# Altium schematic sheet S01-INTERFACES.SchDoc
size B; SheetNumber: 2; SheetTotal: 3; BLOCK-TITLE: SERVO MODULE INTERFACES; BLOCK-SIZE: B; BLOCK-PROJECT: MULTIMOD SERVO MODULE; BLOCK-REVISION: 1; BLOCK-ORGANIZATION: UNIVERSITY OF FLORIDA; BLOCK-DESIGNER: MEHRON TALEBI; BLOCK-IDENTIFIER: SUMMER 2023; BLOCK-REVIEWER: MIKE STAPLETON
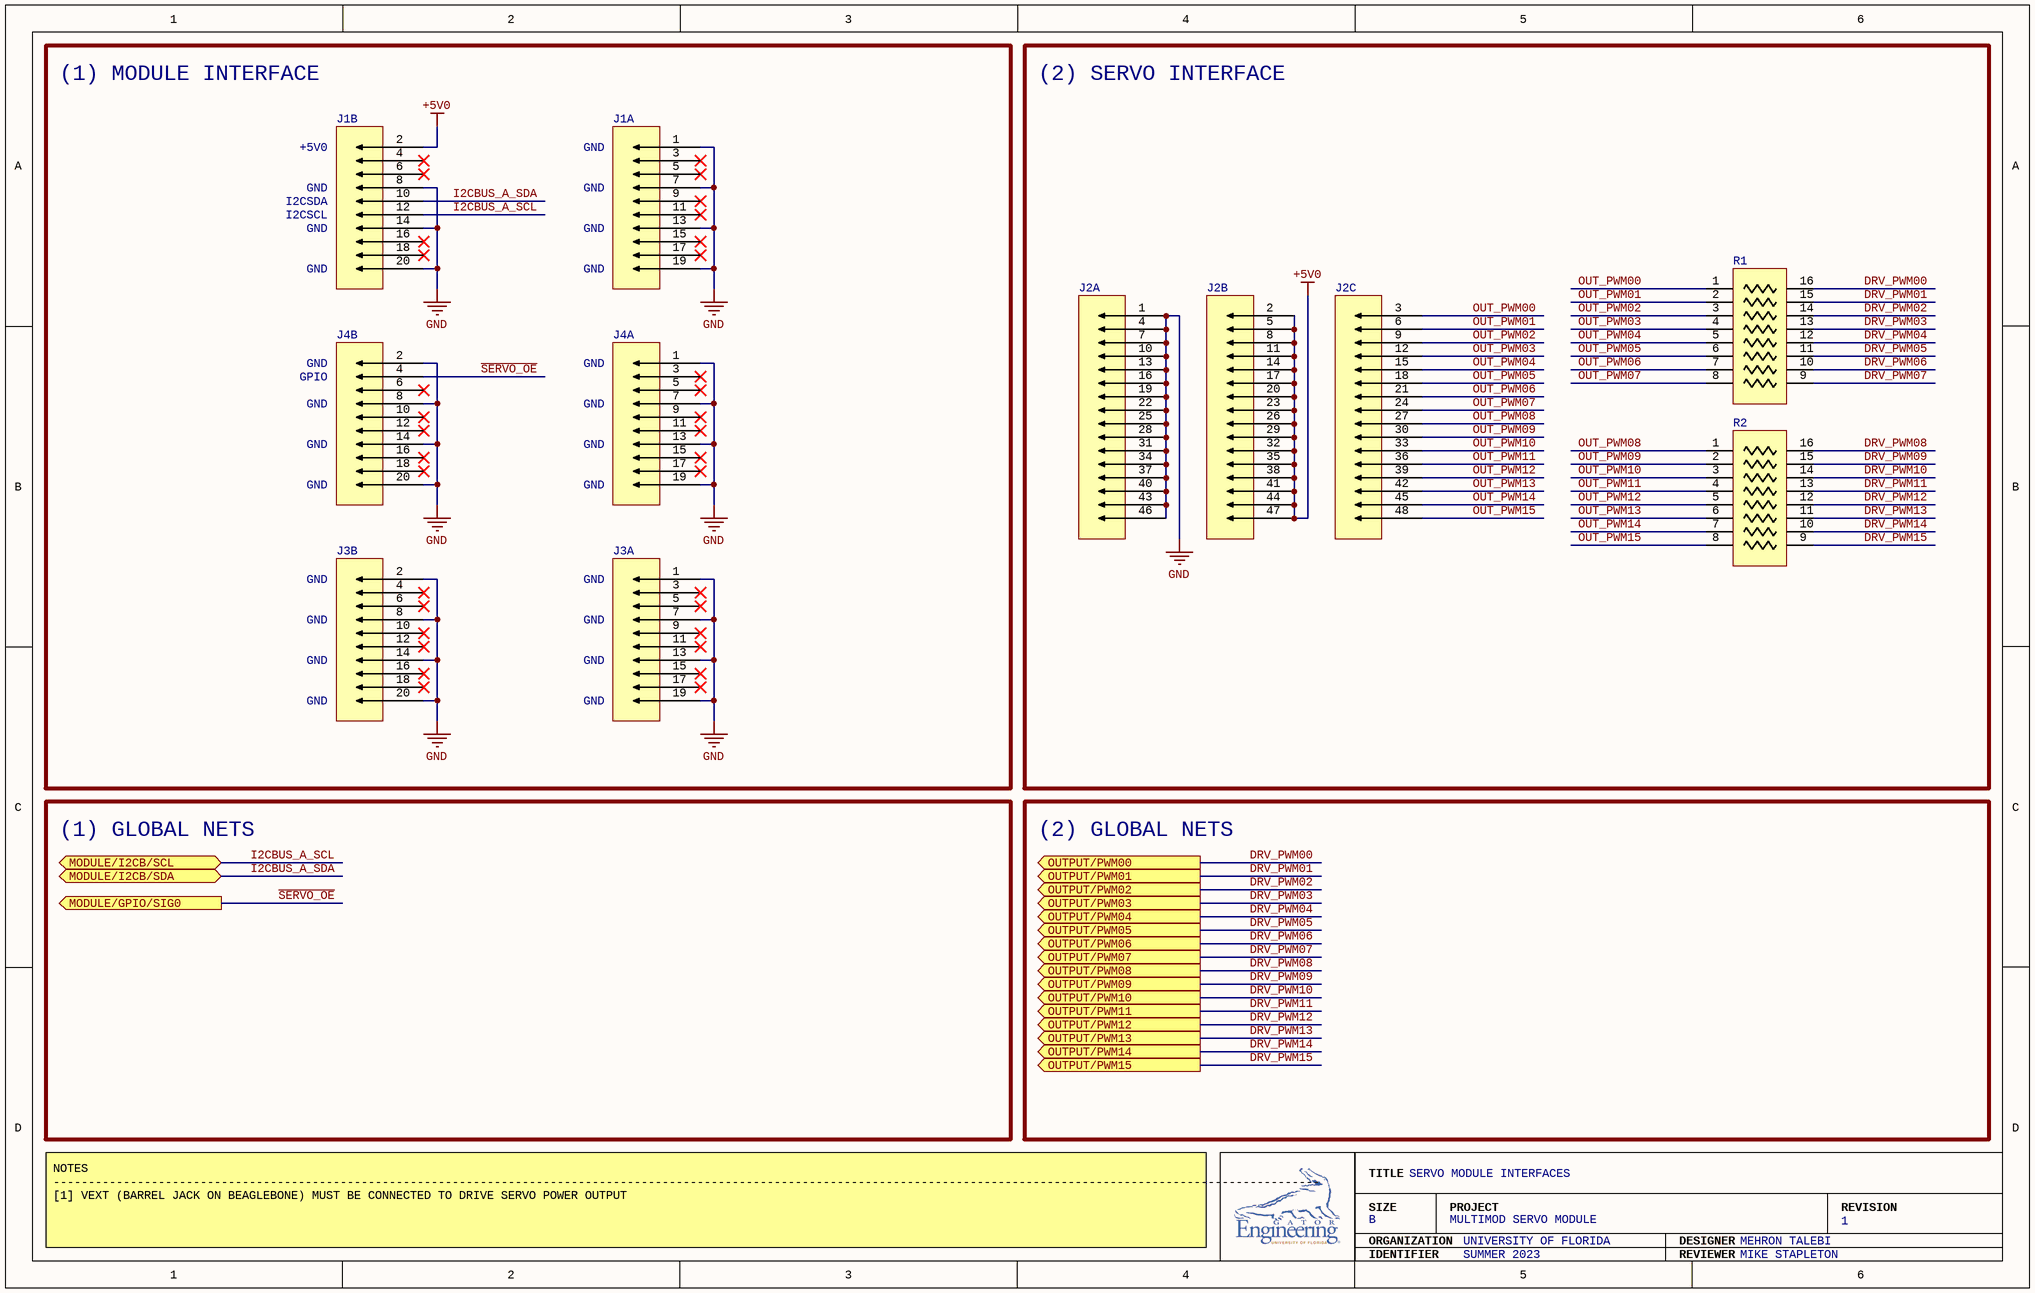
[diagram p0: S01-INTERFACES.SchDoc]

## Parts
J1  NPTC102KFMS-RC  [NPTC102KFMS-RC]  (value not drawn)  (parts A,B of 2)
J2  TSW-116-07-L-T  [TSW-116-07-L-T]  (value not drawn)  (parts A,B,C of 3)
J3  NPTC102KFMS-RC  [NPTC102KFMS-RC]  (value not drawn)  (parts A,B of 2)
J4  NPTC102KFMS-RC  [NPTC102KFMS-RC]  (value not drawn)  (parts A,B of 2)
R1  EXB-2HV221JV  [EXB-2HV221JV]  (value not drawn)
R2  EXB-2HV221JV  [EXB-2HV221JV]  (value not drawn)

## Blocks framed on the sheet
(1) MODULE INTERFACE: J1 J3 J4
(2) SERVO INTERFACE: J2 R1 R2

## Ports
MODULE/GPIO/SIG0 (out), MODULE/I2CB/SCL (bidir), MODULE/I2CB/SDA (bidir), OUTPUT/PWM00 (out), OUTPUT/PWM01 (out), OUTPUT/PWM02 (out), OUTPUT/PWM03 (out), OUTPUT/PWM04 (out), OUTPUT/PWM05 (out), OUTPUT/PWM06 (out), OUTPUT/PWM07 (out), OUTPUT/PWM08 (out), OUTPUT/PWM09 (out), OUTPUT/PWM10 (out), OUTPUT/PWM11 (out), OUTPUT/PWM12 (out), OUTPUT/PWM13 (out), OUTPUT/PWM14 (out), OUTPUT/PWM15 (out)

## Nets
+5V0: J1.2 J2.2 J2.5 J2.8 J2.11 J2.14 J2.17 J2.20 J2.23 J2.26 J2.29 J2.32 J2.35 J2.38 J2.41 J2.44 J2.47
GND: J1.1 J1.7 J1.8 J1.13 J1.14 J1.19 J1.20 J2.1 J2.4 J2.7 J2.10 J2.13 J2.16 J2.19 J2.22 J2.25 J2.28 J2.31 J2.34 J2.37 J2.40 J2.43 J2.46 J3.1 J3.2 J3.7 J3.8 J3.13 J3.14 J3.19 J3.20 J4.1 J4.2 J4.7 J4.8 J4.13 J4.14 J4.19 J4.20
~{SERVO_OE}: J4.4 ; port MODULE/GPIO/SIG0
DRV_PWM00: R1.16 ; port OUTPUT/PWM00
DRV_PWM01: R1.15 ; port OUTPUT/PWM01
DRV_PWM02: R1.14 ; port OUTPUT/PWM02
DRV_PWM03: R1.13 ; port OUTPUT/PWM03
DRV_PWM04: R1.12 ; port OUTPUT/PWM04
DRV_PWM05: R1.11 ; port OUTPUT/PWM05
DRV_PWM06: R1.10 ; port OUTPUT/PWM06
DRV_PWM07: R1.9 ; port OUTPUT/PWM07
DRV_PWM08: R2.16 ; port OUTPUT/PWM08
DRV_PWM09: R2.15 ; port OUTPUT/PWM09
DRV_PWM10: R2.14 ; port OUTPUT/PWM10
DRV_PWM11: R2.13 ; port OUTPUT/PWM11
DRV_PWM12: R2.12 ; port OUTPUT/PWM12
DRV_PWM13: R2.11 ; port OUTPUT/PWM13
DRV_PWM14: R2.10 ; port OUTPUT/PWM14
DRV_PWM15: R2.9 ; port OUTPUT/PWM15
I2CBUS_A_SCL: J1.12 ; port MODULE/I2CB/SCL
I2CBUS_A_SDA: J1.10 ; port MODULE/I2CB/SDA
OUT_PWM00: J2.3 R1.1
OUT_PWM01: J2.6 R1.2
OUT_PWM02: J2.9 R1.3
OUT_PWM03: J2.12 R1.4
OUT_PWM04: J2.15 R1.5
OUT_PWM05: J2.18 R1.6
OUT_PWM06: J2.21 R1.7
OUT_PWM07: J2.24 R1.8
OUT_PWM08: J2.27 R2.1
OUT_PWM09: J2.30 R2.2
OUT_PWM10: J2.33 R2.3
OUT_PWM11: J2.36 R2.4
OUT_PWM12: J2.39 R2.5
OUT_PWM13: J2.42 R2.6
OUT_PWM14: J2.45 R2.7
OUT_PWM15: J2.48 R2.8

Not connected (* = marked no-connect by the designer): J1 3* 4* 5* 6* 9* 11* 15* 16* 17* 18*; J3 3* 4* 5* 6* 9* 10* 11* 12* 15* 16* 17* 18*; J4 3* 5* 6* 9* 10* 11* 12* 15* 16* 17* 18*

## Notes on the sheet
- +5V0
- GND
- I2CSCL
- I2CSDA
- GPIO
- (1) GLOBAL NETS
- (2) GLOBAL NETS
- NOTES
  -------------------------------------------------------------------------------------------------------------------------------------------------------------------------------------
  [1] VEXT (BARREL JACK ON BEAGLEBONE) MUST BE CONNECTED TO DRIVE SERVO POWER OUTPUT
- TITLE
- SIZE
- ORGANIZATION
- PROJECT
- DESIGNER
- REVISION
- IDENTIFIER
- REVIEWER

## Library data of the parts
J1 J3 J4 = NPTC102KFMS-RC: CONN HDR 20POS 0.1 TIN SMD; Connector Type: Header; Style: Board to Board; Number of Positions: 20; Number of Positions Loaded: All; Pitch - Mating: 0.100" (2.54mm); Material Flammability Rating: UL94 V-0; Current Rating (Amps): 3A; Voltage Rating: 250V; System: Connector; Contact Type: Female Socket; Number of Rows: 2; Row Spacing - Mating: 0.100" (2.54mm); Mounting Type: Surface Mount; Termination: Solder; Fastening Type: Push-Pull; Contact Finish - Mating: Tin; Insulation Color: Black; Insulation Height: 0.299" (7.60mm); Operating Temperature: -40°C ~ 125°C; Contact Finish - Post: Tin; Insulation Material: Polyamide (PA6T), Nylon 6T; Contact Shape: Square; Contact Material: Phosphor Bronze; Supplier 1: Digi-Key; Supplier Part Number 1: S5680-ND
J2 = TSW-116-07-L-T: CONN HEADER VERT 48POS 2.54MM; Pitch - Mating: 0.100" (2.54mm); Number of Positions: 48; Number of Positions Loaded: All; Style: Board to Board or Cable; Shrouding: Unshrouded; Contact Length - Mating: 0.230" (5.84mm); Material Flammability Rating: UL94 V-0; Connector Type: Header; Contact Type: Male Pin; Number of Rows: 3; Row Spacing - Mating: 0.100" (2.54mm); Mounting Type: Through Hole, Right Angle; Termination: Solder; Fastening Type: Push-Pull; Contact Length - Post: 0.100" (2.54mm); Insulation Height: 0.100" (2.54mm); Contact Shape: Square; Contact Finish - Mating: Gold; Contact Finish Thickness - Mating: 10.0µin (0.25µm); Contact Finish - Post: Gold; Contact Material: Phosphor Bronze; Insulation Material: Polybutylene Terephthalate (PBT); Operating Temperature: -55°C ~ 125°C; Insulation Color: Black; Contact Finish Thickness - Post: 10.0µin (0.25µm); Supplier 1: Digi-Key; Supplier Part Number 1: SAM12360-ND
R1 R2 = EXB-2HV221JV: RES ARRAY 8 RES 220 OHM 1506; Circuit Type: Isolated; Resistance (Ohms): 220; Tolerance: ±5%; Number of Resistors: 8; Power Per Element: 62.5mW; Temperature Coefficient: ±200ppm/°C; Number of Pins: 16; Operating Temperature: -55°C ~ 125°C; Applications: Automotive AEC-Q200; Mounting Type: Surface Mount; Package / Case: 1506, Convex, Long Side Terminals; Size / Dimension: 0.150" L x 0.063" W (3.80mm x 1.60mm); Height - Seated (Max): 0.022" (0.55mm); Supplier 1: Mouser; Supplier Part Number 1: 667-EXB-2HV221JV